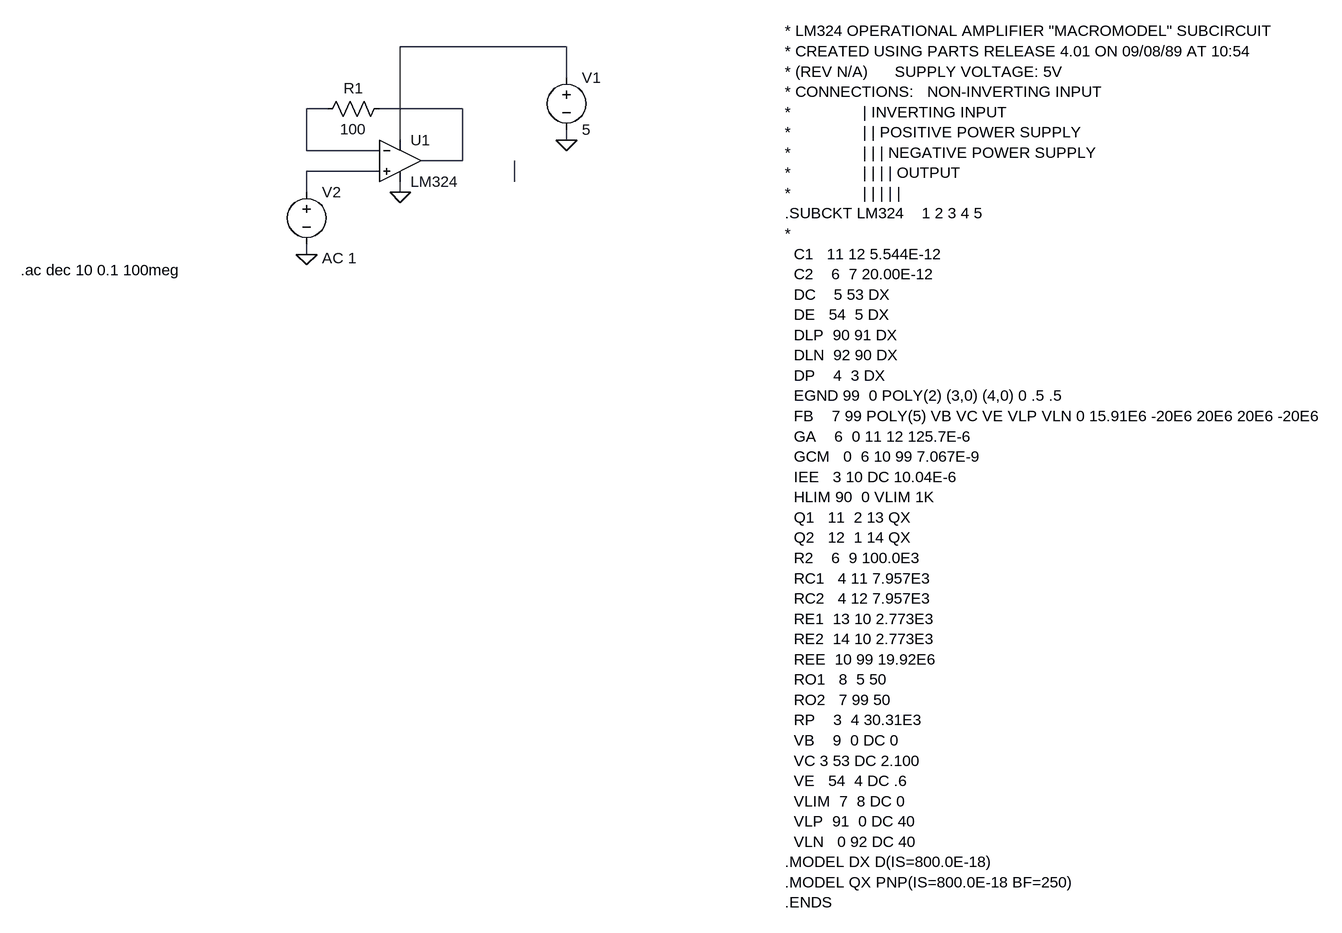
[diagram p0: schematic Draft1.asc]
Draft1.asc, the LTspice schematic file:
Version 4.1
SHEET 1 1116 1040
WIRE 112 80 -144 80
WIRE 112 128 112 80
WIRE -256 176 -288 176
WIRE -48 176 -176 176
WIRE -144 224 -144 80
WIRE 112 224 112 208
WIRE -288 240 -288 176
WIRE -176 240 -288 240
WIRE -48 256 -48 176
WIRE -48 256 -112 256
WIRE -176 272 -288 272
WIRE 32 288 32 256
WIRE -288 304 -288 272
WIRE -144 304 -144 288
WIRE -288 400 -288 384
FLAG -144 304 0
FLAG 112 224 0
FLAG -288 400 0
SYMBOL OpAmps\\opamp2 -144 192 R0
SYMATTR InstName U1
SYMATTR Value LM324
SYMBOL voltage 112 112 R0
WINDOW 123 0 0 Left 0
WINDOW 39 0 0 Left 0
SYMATTR InstName V1
SYMATTR Value 5
SYMBOL voltage -288 288 R0
WINDOW 123 24 118 Left 2
WINDOW 39 0 0 Left 0
SYMATTR InstName V2
SYMATTR Value ""
SYMATTR Value2 AC 1
SYMBOL res -160 160 R90
WINDOW 0 0 56 VBottom 2
WINDOW 3 32 56 VTop 2
SYMATTR InstName R1
SYMATTR Value 100
TEXT 448 56 Left 2 !* LM324 OPERATIONAL AMPLIFIER "MACROMODEL" SUBCIRCUIT\n* CREATED USING PARTS RELEASE 4.01 ON 09/08/89 AT 10:54\n* (REV N/A)      SUPPLY VOLTAGE: 5V\n* CONNECTIONS:   NON-INVERTING INPUT\n*                | INVERTING INPUT\n*                | | POSITIVE POWER SUPPLY\n*                | | | NEGATIVE POWER SUPPLY\n*                | | | | OUTPUT\n*                | | | | |\n.SUBCKT LM324    1 2 3 4 5\n*\n  C1   11 12 5.544E-12\n  C2    6  7 20.00E-12\n  DC    5 53 DX\n  DE   54  5 DX\n  DLP  90 91 DX\n  DLN  92 90 DX\n  DP    4  3 DX\n  EGND 99  0 POLY(2) (3,0) (4,0) 0 .5 .5\n  FB    7 99 POLY(5) VB VC VE VLP VLN 0 15.91E6 -20E6 20E6 20E6 -20E6\n  GA    6  0 11 12 125.7E-6\n  GCM   0  6 10 99 7.067E-9\n  IEE   3 10 DC 10.04E-6\n  HLIM 90  0 VLIM 1K\n  Q1   11  2 13 QX\n  Q2   12  1 14 QX\n  R2    6  9 100.0E3\n  RC1   4 11 7.957E3\n  RC2   4 12 7.957E3\n  RE1  13 10 2.773E3\n  RE2  14 10 2.773E3\n  REE  10 99 19.92E6\n  RO1   8  5 50\n  RO2   7 99 50\n  RP    3  4 30.31E3\n  VB    9  0 DC 0\n  VC 3 53 DC 2.100\n  VE   54  4 DC .6\n  VLIM  7  8 DC 0\n  VLP  91  0 DC 40\n  VLN   0 92 DC 40\n.MODEL DX D(IS=800.0E-18)\n.MODEL QX PNP(IS=800.0E-18 BF=250)\n.ENDS
TEXT -728 424 Left 2 !.ac dec 10 0.1 100meg

The netlist it stands for:
* Draft1.asc
X§U1 N004 N002 N001 0 N003 LM324  ; pins In+ In- V+ V- OUT
V1 N001 0 5
V2 N004 0 AC 1
R1 N003 N002 100
* LM324 OPERATIONAL AMPLIFIER "MACROMODEL" SUBCIRCUIT
* CREATED USING PARTS RELEASE 4.01 ON 09/08/89 AT 10:54
* (REV N/A)      SUPPLY VOLTAGE: 5V
* CONNECTIONS:   NON-INVERTING INPUT
*                | INVERTING INPUT
*                | | POSITIVE POWER SUPPLY
*                | | | NEGATIVE POWER SUPPLY
*                | | | | OUTPUT
*                | | | | |
.SUBCKT LM324    1 2 3 4 5
*
  C1   11 12 5.544E-12
  C2    6  7 20.00E-12
  DC    5 53 DX
  DE   54  5 DX
  DLP  90 91 DX
  DLN  92 90 DX
  DP    4  3 DX
  EGND 99  0 POLY(2) (3,0) (4,0) 0 .5 .5
  FB    7 99 POLY(5) VB VC VE VLP VLN 0 15.91E6 -20E6 20E6 20E6 -20E6
  GA    6  0 11 12 125.7E-6
  GCM   0  6 10 99 7.067E-9
  IEE   3 10 DC 10.04E-6
  HLIM 90  0 VLIM 1K
  Q1   11  2 13 QX
  Q2   12  1 14 QX
  R2    6  9 100.0E3
  RC1   4 11 7.957E3
  RC2   4 12 7.957E3
  RE1  13 10 2.773E3
  RE2  14 10 2.773E3
  REE  10 99 19.92E6
  RO1   8  5 50
  RO2   7 99 50
  RP    3  4 30.31E3
  VB    9  0 DC 0
  VC 3 53 DC 2.100
  VE   54  4 DC .6
  VLIM  7  8 DC 0
  VLP  91  0 DC 40
  VLN   0 92 DC 40
.MODEL DX D(IS=800.0E-18)
.MODEL QX PNP(IS=800.0E-18 BF=250)
.ENDS
.ac dec 10 0.1 100meg
.backanno
.end